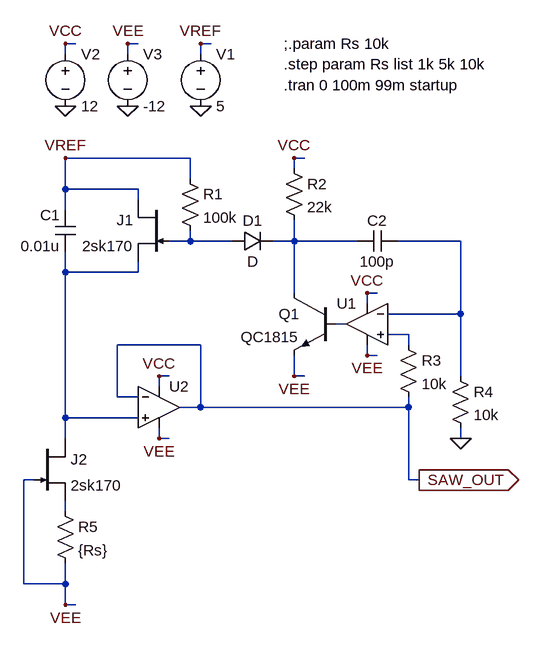
[diagram p0: schematic VCO_Sawtooth_JFET_CurrentSource.asc]
VCO_Sawtooth_JFET_CurrentSource.asc, the LTspice schematic file:
Version 4
SHEET 1 1200 692
WIRE -144 -288 -160 -288
WIRE -48 -288 -64 -288
WIRE 64 -288 48 -288
WIRE -160 -272 -160 -288
WIRE -64 -272 -64 -288
WIRE 48 -272 48 -288
WIRE 32 -112 -160 -112
WIRE 208 -112 192 -112
WIRE 192 -96 192 -112
WIRE 32 -80 32 -112
WIRE -160 -64 -160 -112
WIRE -48 -64 -160 -64
WIRE -48 -48 -48 -64
WIRE -160 -32 -160 -64
WIRE 32 16 32 0
WIRE 32 16 0 16
WIRE 96 16 32 16
WIRE 192 16 192 -16
WIRE 192 16 160 16
WIRE 288 16 192 16
WIRE 448 16 352 16
WIRE -160 64 -160 32
WIRE -48 64 -48 48
WIRE -48 64 -160 64
WIRE 192 96 192 16
WIRE 320 96 304 96
WIRE 304 112 304 96
WIRE 448 128 448 16
WIRE 448 128 336 128
WIRE 272 144 256 144
WIRE 368 160 336 160
WIRE 48 176 -80 176
WIRE 368 176 368 160
WIRE 304 192 304 176
WIRE 320 192 304 192
WIRE 0 224 -16 224
WIRE 192 224 192 192
WIRE 208 224 192 224
WIRE 448 224 448 128
WIRE -16 240 -16 224
WIRE -80 256 -80 176
WIRE -48 256 -80 256
WIRE 48 272 48 176
WIRE 48 272 16 272
WIRE 368 272 368 256
WIRE 368 272 48 272
WIRE -160 288 -160 64
WIRE -48 288 -160 288
WIRE -160 320 -160 288
WIRE -16 320 -16 304
WIRE 0 320 -16 320
WIRE 448 320 448 304
WIRE -208 384 -224 384
WIRE 368 384 368 272
WIRE 384 384 368 384
WIRE -160 432 -160 416
WIRE -224 544 -224 384
WIRE -160 544 -160 512
WIRE -160 544 -224 544
WIRE -160 576 -160 544
WIRE -144 576 -160 576
FLAG -160 -192 0
FLAG -64 -192 0
FLAG -160 -288 VCC
FLAG -64 -288 VEE
FLAG 304 96 VCC
FLAG 304 192 VEE
FLAG 192 -112 VCC
FLAG 192 224 VEE
FLAG 448 320 0
FLAG -16 224 VCC
FLAG -16 320 VEE
FLAG -160 -112 VREF
FLAG 48 -192 0
FLAG 48 -288 VREF
FLAG 384 384 SAW_OUT
IOPIN 384 384 Out
FLAG -160 576 VEE
SYMBOL voltage -160 -288 R0
WINDOW 123 0 0 Left 2
WINDOW 39 0 0 Left 2
SYMATTR InstName V2
SYMATTR Value 12
SYMBOL voltage -64 -288 R0
WINDOW 123 0 0 Left 2
WINDOW 39 0 0 Left 2
SYMATTR InstName V3
SYMATTR Value -12
SYMBOL cap -144 -32 M0
SYMATTR InstName C1
SYMATTR Value 0.01u
SYMBOL njf 0 -48 M0
SYMATTR InstName J1
SYMATTR Value 2sk170
SYMBOL res 16 -96 R0
SYMATTR InstName R1
SYMATTR Value 100k
SYMBOL Opamps\\UniversalOpamp2 304 144 M0
SYMATTR InstName U1
SYMBOL npn 256 96 M0
SYMATTR InstName Q1
SYMATTR Value QC1815
SYMBOL diode 96 32 R270
WINDOW 0 32 32 VTop 2
WINDOW 3 0 32 VBottom 2
SYMATTR InstName D1
SYMBOL res 176 -112 R0
SYMATTR InstName R2
SYMATTR Value 22k
SYMBOL cap 352 0 R90
WINDOW 0 0 32 VBottom 2
WINDOW 3 32 32 VTop 2
SYMATTR InstName C2
SYMATTR Value 100p
SYMBOL res 352 160 R0
SYMATTR InstName R3
SYMATTR Value 10k
SYMBOL res 432 208 R0
SYMATTR InstName R4
SYMATTR Value 10k
SYMBOL Opamps\\UniversalOpamp2 -16 272 R0
SYMATTR InstName U2
SYMBOL voltage 48 -288 R0
WINDOW 123 0 0 Left 2
WINDOW 39 0 0 Left 2
SYMATTR InstName V1
SYMATTR Value 5
SYMBOL njf -208 320 R0
SYMATTR InstName J2
SYMATTR Value 2sk170
SYMBOL res -176 416 R0
SYMATTR InstName R5
SYMATTR Value {Rs}
TEXT 176 -256 Left 2 !.step param Rs list 1k 5k 10k
TEXT 176 -224 Left 2 !.tran 0 100m 99m startup
TEXT 176 -288 Left 2 !;.param Rs 10k

The netlist it stands for:
* VCO_Sawtooth_JFET_CurrentSource.asc
V2 VCC 0 12
V3 VEE 0 -12
C1 VREF N004 0.01u
J1 VREF N001 N004 2sk170
R1 VREF N001 100k
XU1 N006 N003 VCC VEE N005 level.2 Avol=1Meg GBW=10Meg Slew=10Meg ilimit=25m rail=0 Vos=0 phimargin=45 en=0 enk=0 in=0 ink=0 Rin=500Meg  ; pins IN+ IN- V+ V- OUT
Q1 N002 N005 VEE 0 QC1815
D1 N001 N002 D
R2 VCC N002 22k
C2 N003 N002 100p
R3 N006 SAW_OUT 10k
R4 N003 0 10k
XU2 N004 SAW_OUT VCC VEE SAW_OUT level.2 Avol=1Meg GBW=10Meg Slew=10Meg ilimit=25m rail=0 Vos=0 phimargin=45 en=0 enk=0 in=0 ink=0 Rin=500Meg  ; pins IN+ IN- V+ V- OUT
V1 VREF 0 5
J2 N004 VEE N007 2sk170
R5 N007 VEE {Rs}
.model D D
.lib standard.dio
.model NPN NPN
.model PNP PNP
.lib standard.bjt
.model NJF NJF
.model PJF PJF
.lib standard.jft
.step param Rs list 1k 5k 10k
.tran 0 100m 99m startup
;.param Rs 10k
.lib UniversalOpamps2.sub
.backanno
.end